# EAGLE schematic 4017-7Segment (EAGLE 7.6.0)
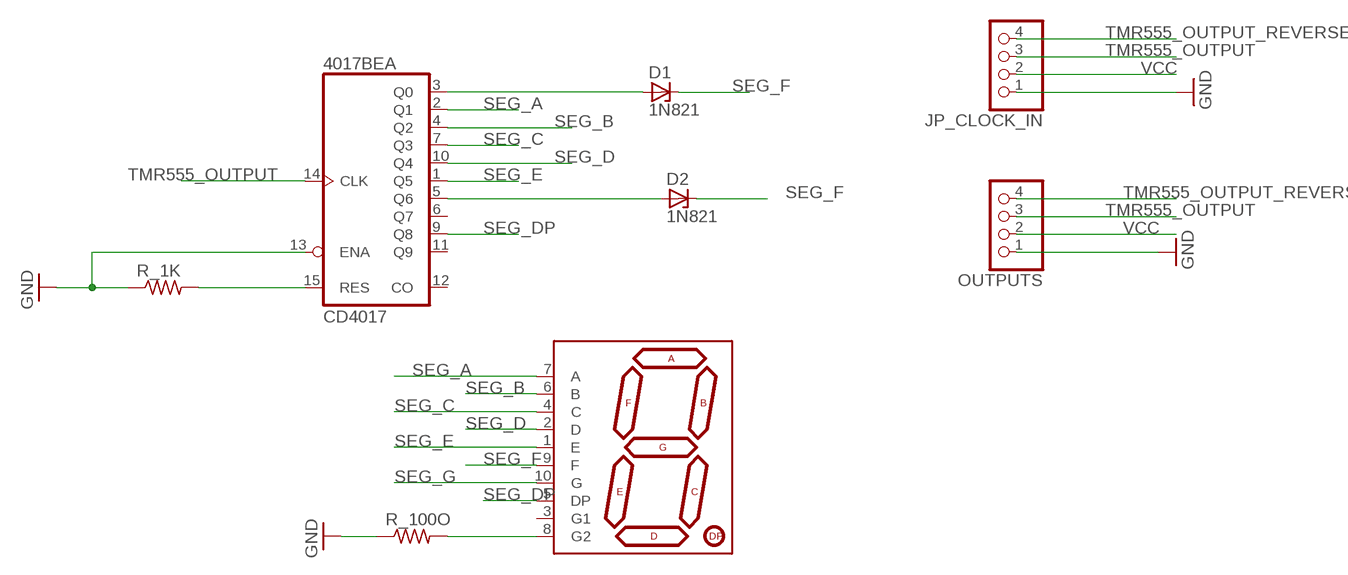
[diagram p0: schematic, sheet 1]

## Parts
4017BE  CD4017  [DIL16]
D1  1N821  [DO35Z10]
D2  1N821  [DO35Z10]
JP_CLOCK_IN  PINHD-1X4  [1X04]
OUTPUTS  PINHD-1X4  [1X04]
R_1K  R-US_R1206  [R1206]
R_100O  R-US_R1206  [R1206]
U$1  7-SEGMENT-DISPLAYPTH  [7-SEGMENT-DISPLAY]

## Nets
GND: 4017BE.13(A:ENA) JP_CLOCK_IN.1 OUTPUTS.1 R_1K.1 R_100O.1
N$1: 4017BE.15(A:RES) R_1K.2
N$2: R_100O.2 U$1.8(G2)
N$3: 4017BE.3(A:Q0) D1.A
N$4: 4017BE.5(A:Q6) D2.A
SEG_A: 4017BE.2(A:Q1) U$1.7(A)
SEG_B: 4017BE.4(A:Q2) U$1.6(B)
SEG_C: 4017BE.7(A:Q3) U$1.4(C)
SEG_D: 4017BE.10(A:Q4) U$1.2(D)
SEG_DP: 4017BE.9(A:Q8) U$1.5(DP)
SEG_E: 4017BE.1(A:Q5) U$1.1(E)
SEG_F: D1.C D2.C U$1.9(F)
SEG_G: U$1.10(G)
TMR555_OUTPUT: 4017BE.14(A:CLK) JP_CLOCK_IN.3 OUTPUTS.3
TMR555_OUTPUT_REVERSE: JP_CLOCK_IN.4 OUTPUTS.4
VCC: JP_CLOCK_IN.2 OUTPUTS.2
Unconnected: 4017BE.6(A:Q7) 4017BE.11(A:Q9) 4017BE.12(A:CO) U$1.3(G1)

## Power pins joined to a net without a drawn wire
GND: 4017BE.8(P:GND)
VCC: 4017BE.16(P:VCC)

## Library data of the parts
4017BE = SparkFun-DigitalIC:CD4017; PROD_ID: IC-11929
D1 D2 = diode:1N821: Reference DIODE temperature compensated, 6,2 V
JP_CLOCK_IN OUTPUTS = pinhead:PINHD-1X4: PIN HEADER
R_1K R_100O = adafruit:R-US_: RESISTOR, American symbol
U$1 = SparkFun-Displays:7-SEGMENT-DISPLAY